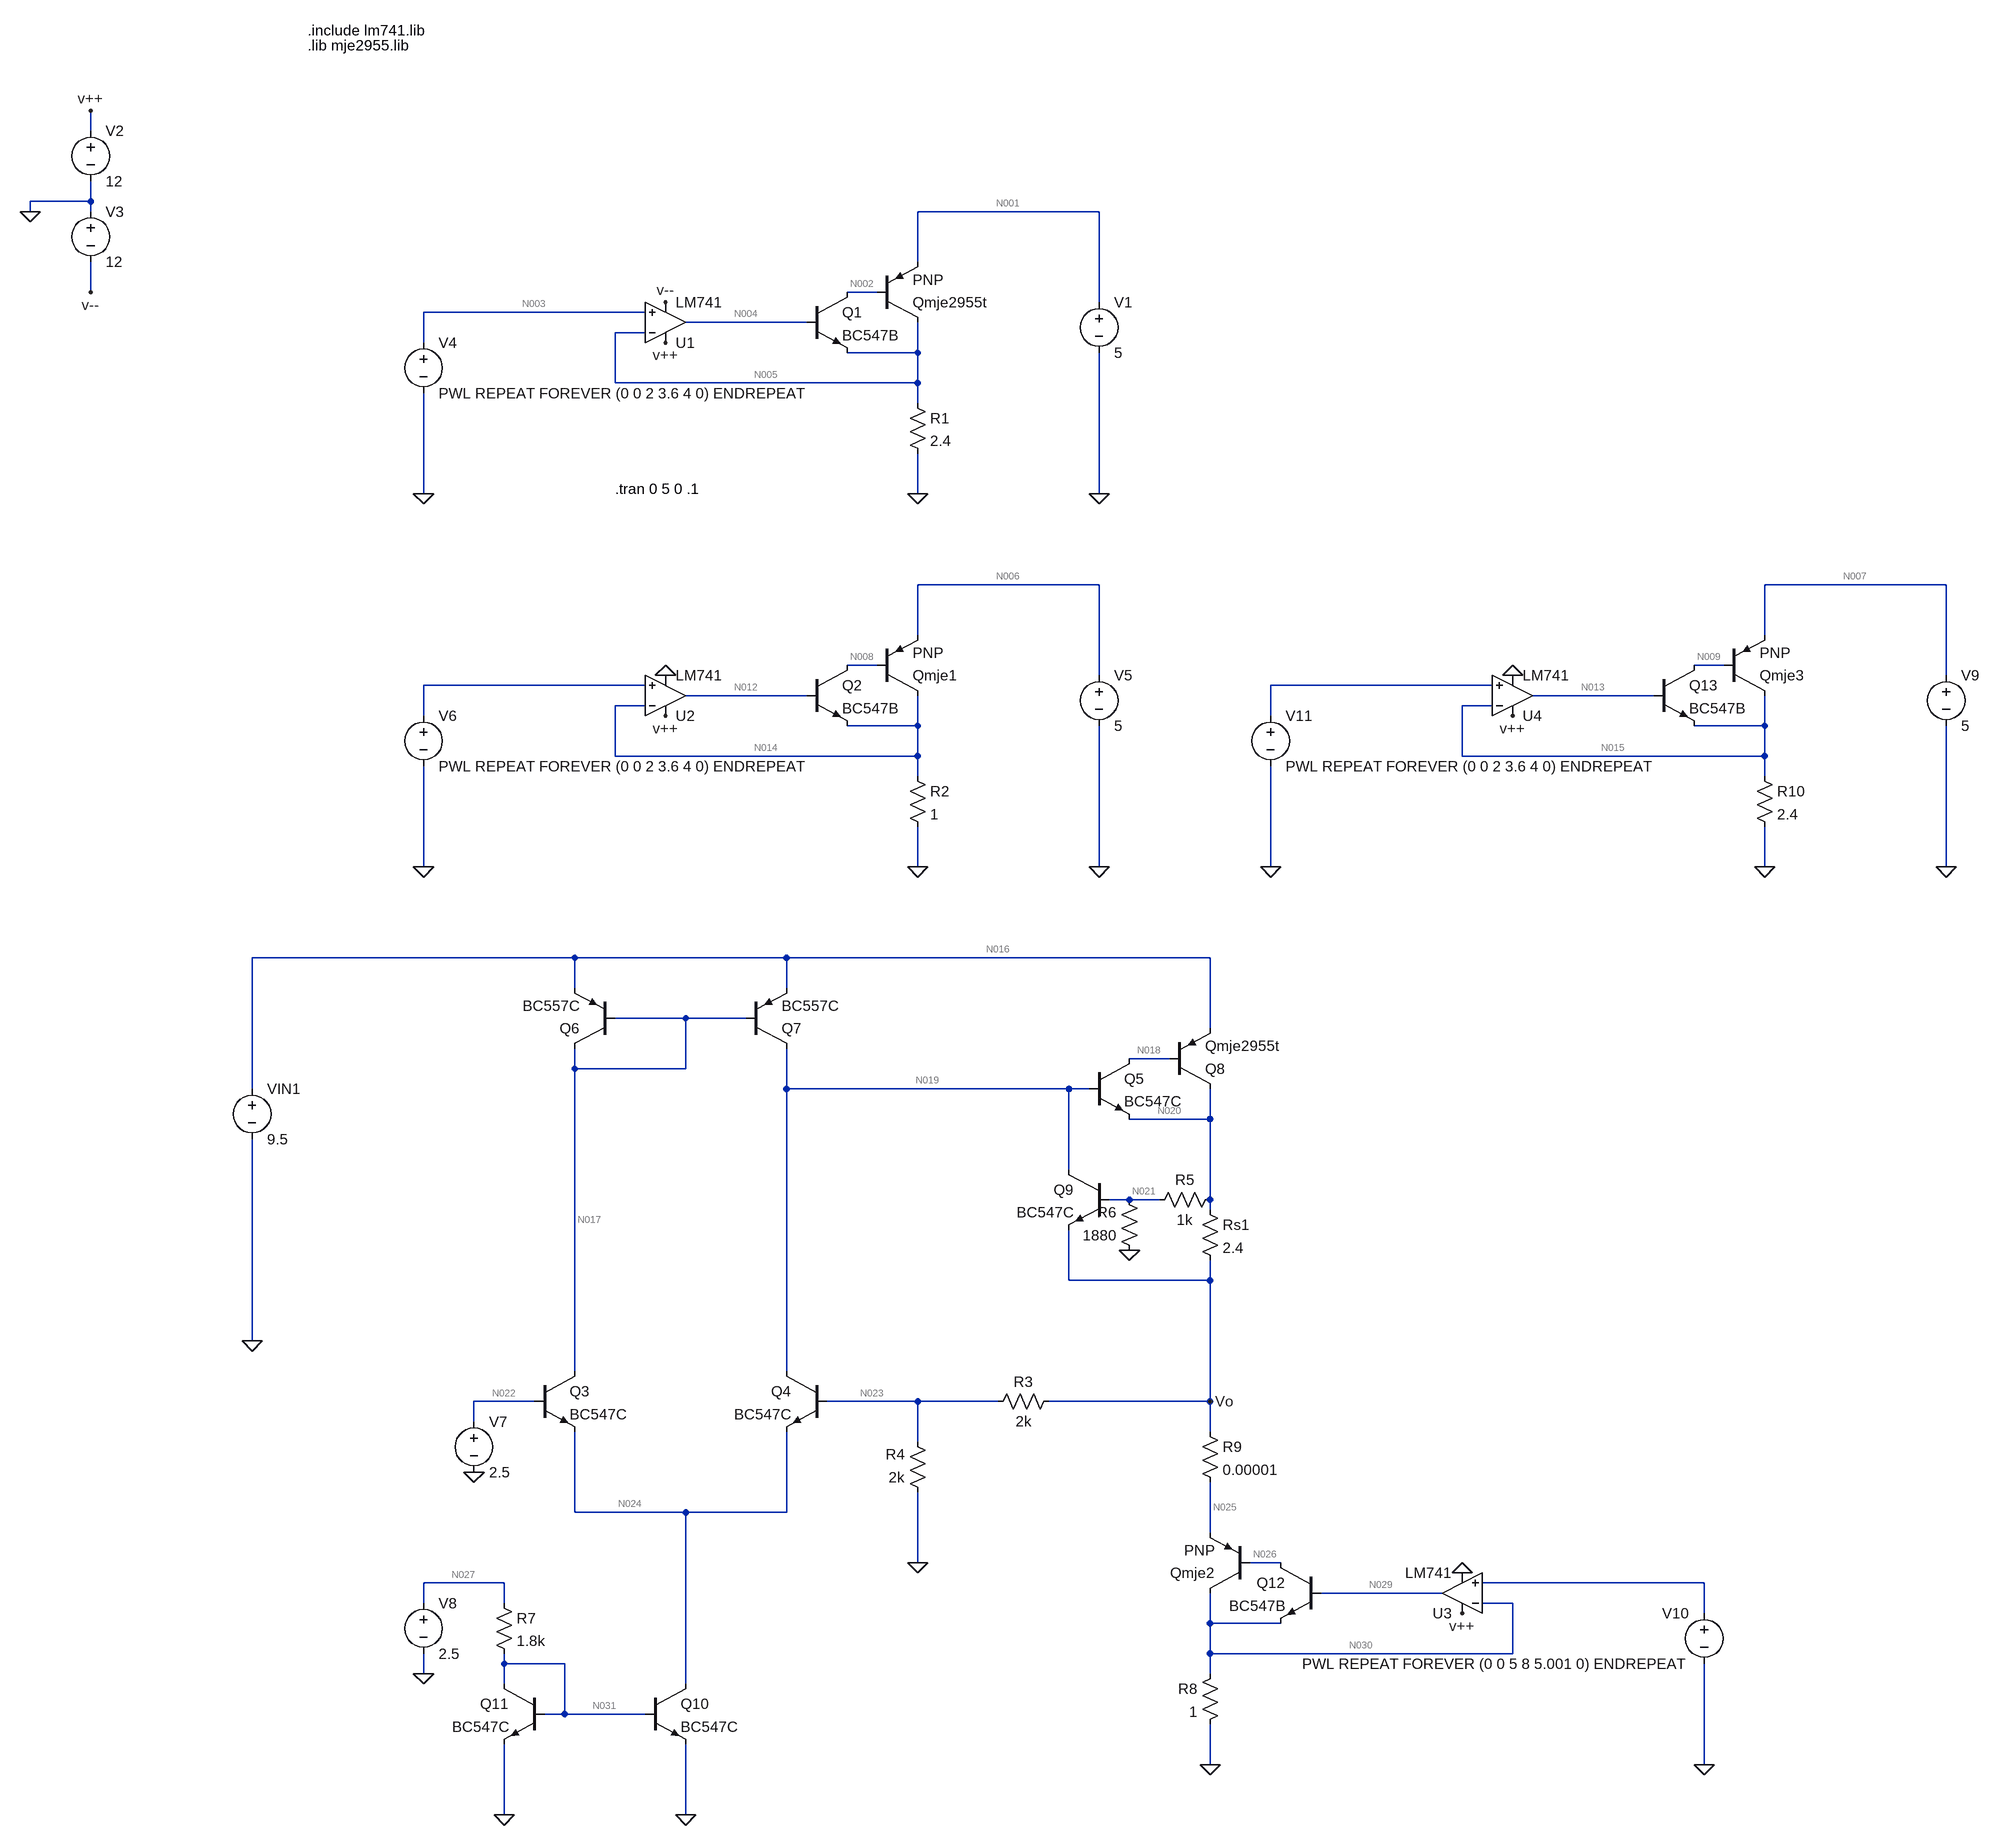
[diagram p0: schematic MK1.asc]
MK1.asc, the LTspice schematic file:
Version 4.1
SHEET 1 2856 2692
WIRE -144 0 -144 -32
WIRE -144 112 -144 80
WIRE -144 112 -240 112
WIRE -240 128 -240 112
WIRE -144 128 -144 112
WIRE 1456 128 1168 128
WIRE 1168 208 1168 128
WIRE -144 256 -144 208
WIRE 1104 256 1056 256
WIRE 1456 272 1456 128
WIRE 736 288 384 288
WIRE 992 304 800 304
WIRE 736 320 688 320
WIRE 384 336 384 288
WIRE 1168 352 1168 304
WIRE 1168 352 1056 352
WIRE 688 400 688 320
WIRE 1168 400 1168 352
WIRE 1168 400 688 400
WIRE 1168 432 1168 400
WIRE 384 576 384 416
WIRE 1168 576 1168 512
WIRE 1456 576 1456 352
WIRE 1456 720 1168 720
WIRE 2800 720 2512 720
WIRE 1168 800 1168 720
WIRE 2512 800 2512 720
WIRE 1104 848 1056 848
WIRE 2448 848 2400 848
WIRE 1456 864 1456 720
WIRE 2800 864 2800 720
WIRE 736 880 384 880
WIRE 2080 880 1728 880
WIRE 992 896 800 896
WIRE 2336 896 2144 896
WIRE 736 912 688 912
WIRE 2080 912 2032 912
WIRE 384 928 384 880
WIRE 1728 928 1728 880
WIRE 1168 944 1168 896
WIRE 1168 944 1056 944
WIRE 2512 944 2512 896
WIRE 2512 944 2400 944
WIRE 688 992 688 912
WIRE 1168 992 1168 944
WIRE 1168 992 688 992
WIRE 2032 992 2032 912
WIRE 2512 992 2512 944
WIRE 2512 992 2032 992
WIRE 1168 1024 1168 992
WIRE 2512 1024 2512 992
WIRE 384 1168 384 1008
WIRE 1168 1168 1168 1104
WIRE 1456 1168 1456 944
WIRE 1728 1168 1728 1008
WIRE 2512 1168 2512 1104
WIRE 2800 1168 2800 944
WIRE 624 1312 112 1312
WIRE 960 1312 624 1312
WIRE 1632 1312 960 1312
WIRE 624 1360 624 1312
WIRE 960 1360 960 1312
WIRE 800 1408 688 1408
WIRE 896 1408 800 1408
WIRE 1632 1424 1632 1312
WIRE 1568 1472 1504 1472
WIRE 624 1488 624 1456
WIRE 800 1488 800 1408
WIRE 800 1488 624 1488
WIRE 112 1520 112 1312
WIRE 960 1520 960 1456
WIRE 1408 1520 960 1520
WIRE 1440 1520 1408 1520
WIRE 1632 1568 1632 1520
WIRE 1632 1568 1504 1568
WIRE 1408 1648 1408 1520
WIRE 1504 1696 1472 1696
WIRE 1552 1696 1504 1696
WIRE 1632 1696 1632 1568
WIRE 1632 1712 1632 1696
WIRE 1408 1824 1408 1744
WIRE 1632 1824 1632 1792
WIRE 1632 1824 1408 1824
WIRE 112 1920 112 1600
WIRE 624 1968 624 1488
WIRE 960 1968 960 1520
WIRE 560 2016 464 2016
WIRE 1168 2016 1024 2016
WIRE 1296 2016 1168 2016
WIRE 1632 2016 1632 1824
WIRE 1632 2016 1376 2016
WIRE 464 2048 464 2016
WIRE 1632 2064 1632 2016
WIRE 1168 2080 1168 2016
WIRE 624 2192 624 2064
WIRE 800 2192 624 2192
WIRE 960 2192 960 2064
WIRE 960 2192 800 2192
WIRE 1632 2224 1632 2144
WIRE 1168 2272 1168 2160
WIRE 1744 2272 1696 2272
WIRE 512 2304 384 2304
WIRE 2416 2304 2064 2304
WIRE 2000 2320 1808 2320
WIRE 384 2336 384 2304
WIRE 512 2336 512 2304
WIRE 2112 2336 2064 2336
WIRE 2416 2352 2416 2304
WIRE 1632 2368 1632 2320
WIRE 1744 2368 1632 2368
WIRE 1632 2416 1632 2368
WIRE 2112 2416 2112 2336
WIRE 2112 2416 1632 2416
WIRE 512 2432 512 2416
WIRE 608 2432 512 2432
WIRE 384 2448 384 2416
WIRE 1632 2448 1632 2416
WIRE 512 2464 512 2432
WIRE 800 2464 800 2192
WIRE 608 2512 608 2432
WIRE 608 2512 576 2512
WIRE 736 2512 608 2512
WIRE 1632 2592 1632 2528
WIRE 2416 2592 2416 2432
WIRE 512 2672 512 2560
WIRE 800 2672 800 2560
FLAG -240 128 0
FLAG -144 -32 v++
FLAG 768 336 v++
FLAG -144 256 v--
FLAG 768 272 v--
FLAG 1168 576 0
FLAG 384 576 0
FLAG 1456 576 0
FLAG 768 928 v++
FLAG 1168 1168 0
FLAG 384 1168 0
FLAG 1456 1168 0
FLAG 768 864 0
FLAG 464 2128 0
FLAG 112 1920 0
FLAG 1168 2272 0
FLAG 1504 1776 0
FLAG 800 2672 0
FLAG 512 2672 0
FLAG 384 2448 0
FLAG 2032 2352 v++
FLAG 1632 2592 0
FLAG 2416 2592 0
FLAG 1632 2016 Vo
FLAG 2032 2288 0
FLAG 2112 928 v++
FLAG 2512 1168 0
FLAG 1728 1168 0
FLAG 2800 1168 0
FLAG 2112 864 0
SYMBOL OpAmps\\opamp2 768 368 M180
SYMATTR InstName U1
SYMATTR Value LM741
SYMBOL voltage -144 -16 R0
WINDOW 123 0 0 Left 0
WINDOW 39 0 0 Left 0
SYMATTR InstName V2
SYMATTR Value 12
SYMBOL voltage -144 112 R0
WINDOW 123 0 0 Left 0
WINDOW 39 0 0 Left 0
SYMATTR InstName V3
SYMATTR Value 12
SYMBOL npn 992 256 R0
SYMATTR InstName Q1
SYMATTR Value BC547B
SYMBOL pnp 1104 304 M180
SYMATTR InstName Qmje2955t
SYMBOL res 1152 416 R0
SYMATTR InstName R1
SYMATTR Value 2.4
SYMBOL voltage 1456 256 R0
WINDOW 123 0 0 Left 0
WINDOW 39 0 0 Left 0
SYMATTR InstName V1
SYMATTR Value 5
SYMBOL voltage 384 320 R0
SYMATTR InstName V4
SYMATTR Value PWL REPEAT FOREVER (0 0 2 3.6 4 0) ENDREPEAT
SYMBOL OpAmps\\opamp2 768 960 M180
SYMATTR InstName U2
SYMATTR Value LM741
SYMBOL npn 992 848 R0
SYMATTR InstName Q2
SYMATTR Value BC547B
SYMBOL pnp 1104 896 M180
SYMATTR InstName Qmje1
SYMBOL res 1152 1008 R0
SYMATTR InstName R2
SYMATTR Value 1
SYMBOL voltage 1456 848 R0
WINDOW 123 0 0 Left 0
WINDOW 39 0 0 Left 0
SYMATTR InstName V5
SYMATTR Value 5
SYMBOL voltage 384 912 R0
SYMATTR InstName V6
SYMATTR Value PWL REPEAT FOREVER (0 0 2 3.6 4 0) ENDREPEAT
SYMBOL npn 560 1968 R0
SYMATTR InstName Q3
SYMATTR Value BC547C
SYMBOL npn 1024 1968 M0
SYMATTR InstName Q4
SYMATTR Value BC547C
SYMBOL npn 1440 1472 R0
SYMATTR InstName Q5
SYMATTR Value BC547C
SYMBOL pnp 688 1456 R180
SYMATTR InstName Q6
SYMATTR Value BC557C
SYMBOL pnp 896 1456 M180
SYMATTR InstName Q7
SYMATTR Value BC557C
SYMBOL voltage 464 2032 R0
WINDOW 123 24 124 Left 2
WINDOW 39 0 0 Left 0
SYMATTR InstName V7
SYMATTR Value 2.5
SYMBOL voltage 112 1504 R0
WINDOW 123 0 0 Left 0
WINDOW 39 0 0 Left 0
SYMATTR InstName VIN1
SYMATTR Value 9.5
SYMBOL pnp 1568 1520 M180
SYMATTR InstName Q8
SYMATTR Value Qmje2955t
SYMBOL res 1392 2000 R90
WINDOW 0 0 56 VBottom 2
WINDOW 3 32 56 VTop 2
SYMATTR InstName R3
SYMATTR Value 2k
SYMBOL res 1184 2176 R180
WINDOW 0 36 76 Left 2
WINDOW 3 36 40 Left 2
SYMATTR InstName R4
SYMATTR Value 2k
SYMBOL npn 1472 1648 M0
SYMATTR InstName Q9
SYMATTR Value BC547C
SYMBOL res 1616 1696 R0
SYMATTR InstName Rs1
SYMATTR Value 2.4
SYMBOL res 1648 1680 R90
WINDOW 0 0 56 VBottom 2
WINDOW 3 32 56 VTop 2
SYMATTR InstName R5
SYMATTR Value 1k
SYMBOL res 1520 1792 R180
WINDOW 0 36 76 Left 2
WINDOW 3 36 40 Left 2
SYMATTR InstName R6
SYMATTR Value 1880
SYMBOL npn 736 2464 R0
SYMATTR InstName Q10
SYMATTR Value BC547C
SYMBOL npn 576 2464 M0
SYMATTR InstName Q11
SYMATTR Value BC547C
SYMBOL res 496 2320 R0
SYMATTR InstName R7
SYMATTR Value 1.8k
SYMBOL voltage 384 2320 R0
WINDOW 123 24 124 Left 2
WINDOW 39 0 0 Left 0
SYMATTR InstName V8
SYMATTR Value 2.5
SYMBOL OpAmps\\opamp2 2032 2384 R180
SYMATTR InstName U3
SYMATTR Value LM741
SYMBOL npn 1808 2272 M0
SYMATTR InstName Q12
SYMATTR Value BC547B
SYMBOL pnp 1696 2320 R180
SYMATTR InstName Qmje2
SYMBOL res 1648 2432 M0
SYMATTR InstName R8
SYMATTR Value 1
SYMBOL voltage 2416 2336 M0
SYMATTR InstName V10
SYMATTR Value PWL REPEAT FOREVER (0 0 5 8 5.001 0) ENDREPEAT
SYMBOL res 1616 2048 R0
SYMATTR InstName R9
SYMATTR Value 0.00001
SYMBOL OpAmps\\opamp2 2112 960 M180
SYMATTR InstName U4
SYMATTR Value LM741
SYMBOL npn 2336 848 R0
SYMATTR InstName Q13
SYMATTR Value BC547B
SYMBOL pnp 2448 896 M180
SYMATTR InstName Qmje3
SYMBOL res 2496 1008 R0
SYMATTR InstName R10
SYMATTR Value 2.4
SYMBOL voltage 2800 848 R0
WINDOW 123 0 0 Left 0
WINDOW 39 0 0 Left 0
SYMATTR InstName V9
SYMATTR Value 5
SYMBOL voltage 1728 912 R0
SYMATTR InstName V11
SYMATTR Value PWL REPEAT FOREVER (0 0 2 3.6 4 0) ENDREPEAT
TEXT 200 -160 Left 2 !.include lm741.lib
TEXT 200 -136 Left 2 !.lib mje2955.lib
TEXT 688 568 Left 2 !.tran 0 5 0 .1

The netlist it stands for:
* MK1.asc
X§U1 N003 N005 v++ v-- N004 LM741  ; pins In+ In- V+ V- OUT
V2 v++ 0 12
V3 0 v-- 12
Q1 N002 N004 N005 0 BC547B
Qmje2955t N005 N002 N001 0 PNP
R1 N005 0 2.4
V1 N001 0 5
V4 N003 0 PWL REPEAT FOREVER (0 0 2 3.6 4 0) ENDREPEAT
X§U2 N010 N014 v++ 0 N012 LM741  ; pins In+ In- V+ V- OUT
Q2 N008 N012 N014 0 BC547B
Qmje1 N014 N008 N006 0 PNP
R2 N014 0 1
V5 N006 0 5
V6 N010 0 PWL REPEAT FOREVER (0 0 2 3.6 4 0) ENDREPEAT
Q3 N017 N022 N024 0 BC547C
Q4 N019 N023 N024 0 BC547C
Q5 N018 N019 N020 0 BC547C
Q6 N017 N017 N016 0 BC557C
Q7 N019 N017 N016 0 BC557C
V7 N022 0 2.5
VIN1 N016 0 9.5
Q8 N020 N018 N016 0 Qmje2955t
R3 Vo N023 2k
R4 0 N023 2k
Q9 N019 N021 Vo 0 BC547C
Rs1 N020 Vo 2.4
R5 N020 N021 1k
R6 0 N021 1880
Q10 N024 N031 0 0 BC547C
Q11 N031 N031 0 0 BC547C
R7 N027 N031 1.8k
V8 N027 0 2.5
X§U3 N028 N030 v++ 0 N029 LM741  ; pins In+ In- V+ V- OUT
Q12 N026 N029 N030 0 BC547B
Qmje2 N030 N026 N025 0 PNP
R8 N030 0 1
V10 N028 0 PWL REPEAT FOREVER (0 0 5 8 5.001 0) ENDREPEAT
R9 Vo N025 0.00001
X§U4 N011 N015 v++ 0 N013 LM741  ; pins In+ In- V+ V- OUT
Q13 N009 N013 N015 0 BC547B
Qmje3 N015 N009 N007 0 PNP
R10 N015 0 2.4
V9 N007 0 5
V11 N011 0 PWL REPEAT FOREVER (0 0 2 3.6 4 0) ENDREPEAT
.model NPN NPN
.model PNP PNP
.lib standard.bjt
.include lm741.lib
.lib mje2955.lib
.tran 0 5 0 .1
.backanno
.end

* Results of the author's LTspice run, read from the files saved beside the schematic
* Operating Point, zero values left out:
*   V(n005) = 997.5 µV
*   V(n004) = 494.4 mV
*   V(n012) = 970.9 mV
*   V(n017) = 8.9 V
*   V(n018) = 8.996 V
*   V(n031) = 622.9 mV
*   V(n030) = 303.3 mV
*   V(n015) = 326.3 mV
*   V(n007) = 5 V
*   V(v--) = -12 V
*   V(n001) = 5 V
*   V(n006) = 5 V
*   V(n024) = 1.899 V
*   V(n016) = 9.5 V
*   V(n026) = 4.087 V
*   V(n009) = 4.099 V
*   V(n002) = 4.249 V
*   V(n014) = 303.3 mV
*   V(n022) = 2.5 V
*   V(n023) = 2.503 V
*   V(n020) = 5.74 V
*   V(n021) = 3.747 V
*   V(n029) = 970.9 mV
*   V(n025) = 5.009 V
*   V(v++) = 12 V
*   V(n008) = 4.078 V
*   V(n019) = 6.385 V
*   V(vo) = 5.009 V
*   V(n027) = 2.5 V
*   V(n013) = 972 mV
*   I(R2) = 303.3 mA
*   Ic(Qmje2) = -300.3 mA
*   Ib(Qmje2) = -3.003 mA
*   Ie(Qmje2) = 303.3 mA
*   Ic(Qmje2955t) = -411.6 µA
*   Ib(Qmje2955t) = -4.116 µA
*   Ie(Qmje2955t) = 415.7 µA
*   Ic(Q2) = 3.002 mA
*   Ib(Q2) = 10.25 µA
*   Ie(Q2) = -3.013 mA
*   I(V7) = -998.2 nA
*   I(R3) = 1.253 mA
*   I(R6) = -1.993 mA
*   I(V4) = -57.87 nA
*   Ic(Q3) = 507.9 µA
*   Ib(Q3) = 998.2 nA
*   Ie(Q3) = -508.9 µA
*   I(R9) = 303.3 mA
*   I(R10) = 136 mA
*   I(V10) = 626.5 nA
*   I(V1) = -415.7 µA
*   Ic(Q5) = 2.525 mA
*   Ib(Q5) = 5.366 µA
*   Ie(Q5) = -2.531 mA
*   Ic(Q8) = -304 mA
*   Ib(Q8) = -2.525 mA
*   Ie(Q8) = 306.5 mA
*   Ic(Q9) = 2.666 pA
*   Ib(Q9) = -3.93 pA
*   Ie(Q9) = 1.265 pA
*   I(V2) = -5.742 mA
*   Ic(Q11) = 1.038 mA
*   Ib(Q11) = 2.295 µA
*   Ie(Q11) = -1.041 mA
*   I(V11) = 672.7 nA
*   I(V6) = 626.5 nA
*   Ic(Q10) = 1.063 mA
*   Ib(Q10) = 2.295 µA
*   Ie(Q10) = -1.066 mA
*   I(R5) = 1.993 mA
*   Ic(Q12) = 3.003 mA
*   Ib(Q12) = 10.25 µA
*   Ie(Q12) = -3.013 mA
*   Ic(Q1) = 4.116 µA
*   Ib(Q1) = 14.28 nA
*   Ie(Q1) = -4.13 µA
*   Ic(Qmje1) = -300.2 mA
*   Ib(Qmje1) = -3.002 mA
*   Ie(Qmje1) = 303.2 mA
*   Ic(Q7) = -558.6 µA
*   Ib(Q7) = -1.136 µA
*   Ie(Q7) = 559.7 µA
*   I(R4) = -1.252 mA
*   Ic(Q4) = 553.2 µA
*   Ib(Q4) = 1.136 µA
*   Ie(Q4) = -554.4 µA
*   Ic(Qmje3) = -134.6 mA
*   Ib(Qmje3) = -1.346 mA
*   Ie(Qmje3) = 136 mA
*   I(V8) = -1.043 mA
*   I(Rs1) = 304.5 mA
*   Ic(Q13) = 1.346 mA
*   Ib(Q13) = 4.546 µA
*   Ie(Q13) = -1.351 mA
*   I(V5) = -303.2 mA
*   I(VIN1) = -307.6 mA
*   I(V3) = -1.626 mA
*   I(R1) = 415.6 µA
*   Ic(Q6) = -505.6 µA
*   Ib(Q6) = -1.137 µA
*   Ie(Q6) = 506.7 µA
*   I(R7) = 1.043 mA
*   I(R8) = 303.3 mA
*   I(V9) = -136 mA
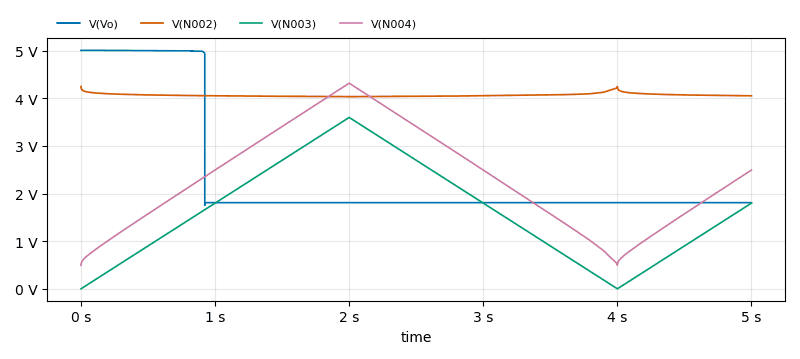
[diagram p1: Transient Analysis of MK1.asc, plotted from the saved traces]
* Transient Analysis, 1 run:
*   V(Vo): min 1.754 V, max 5.009 V, average 2.399 V, rms 2.7 V, last 1.81 V
*   V(N002): min 4.037 V, max 4.249 V, average 4.068 V, rms 4.068 V, last 4.055 V
*   V(N003): min 0 V, max 3.6 V, average 1.62 V, rms 1.953 V, last 1.8 V
*   V(N004): min 494.4 mV, max 4.32 V, average 2.302 V, rms 2.56 V, last 2.496 V